# EasyEDA Pro project 智能母版V3.eprj

# Schematic Schematic1

## Sheets
1 电源: Create Date: 2024-02-19; Page Name: 电源; Project Name: 智能母版V3; Schematic Name: Schematic1; Update Date: 2024-02-22; Company: 嘉立创EDA; Page Size: A4; Version: V1.0
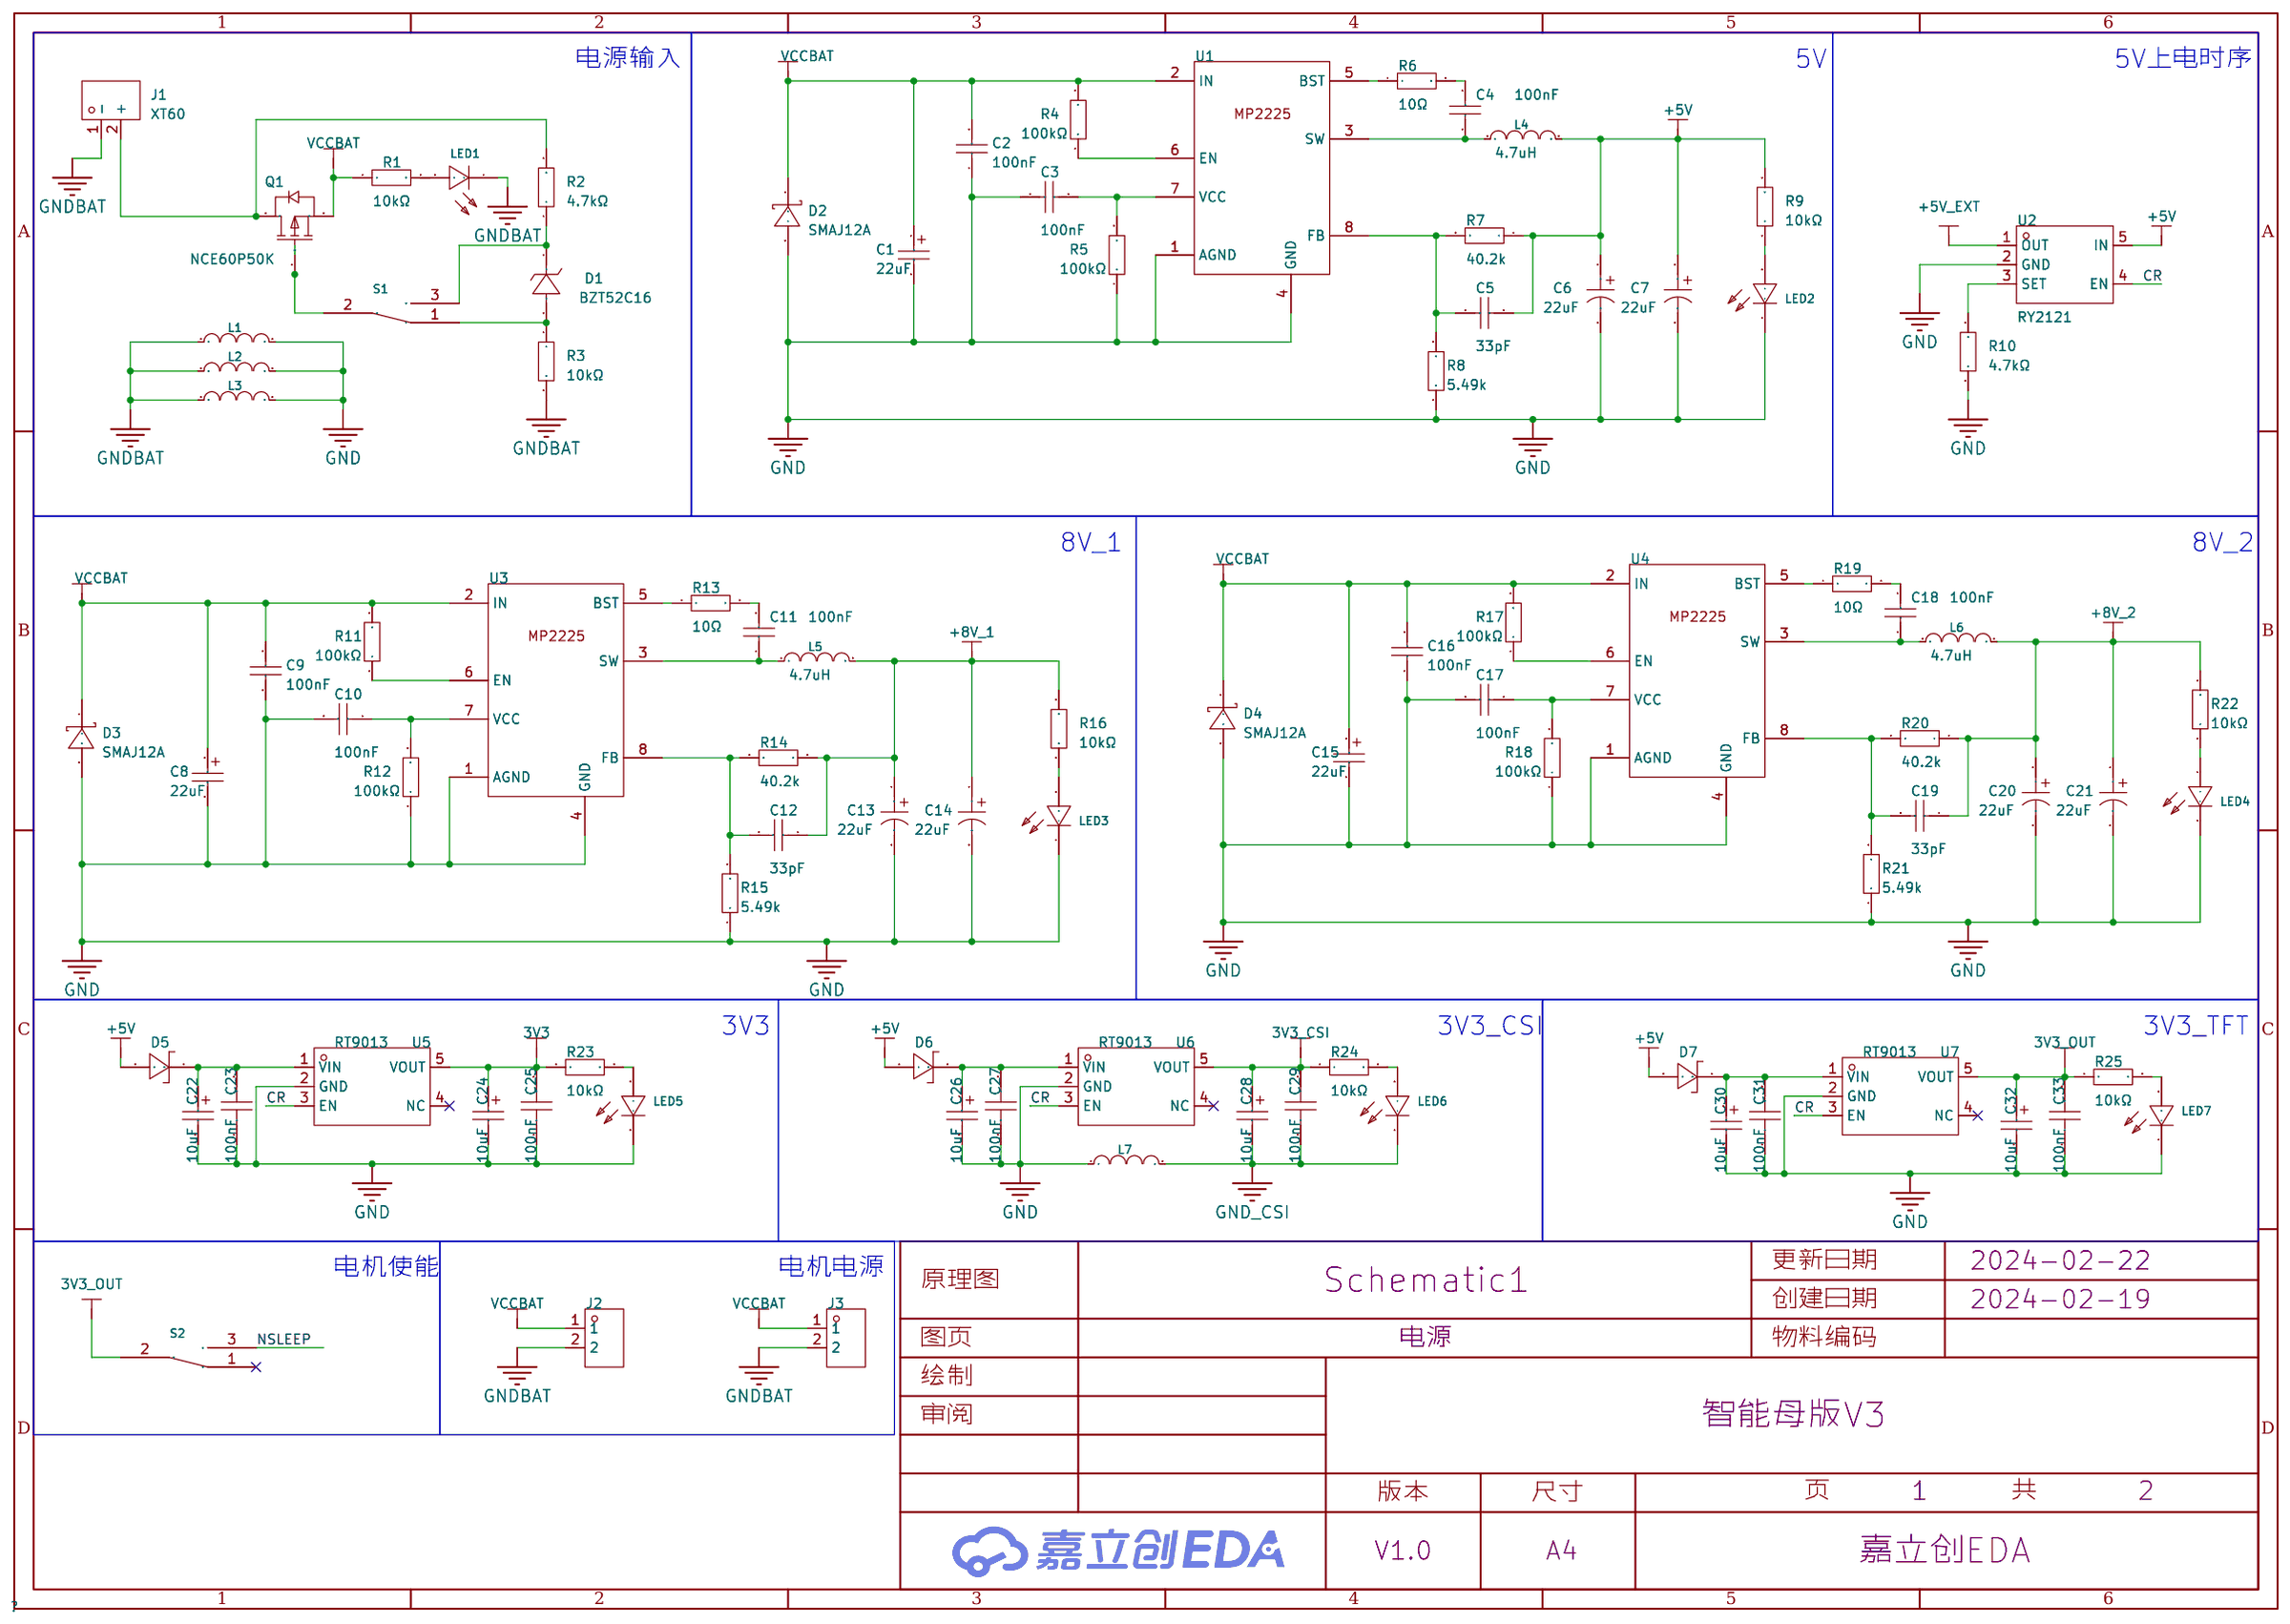
[diagram p0: 电源]
2 外设: Create Date: 2024-02-22; Page Name: 外设; Update Date: 2024-02-23
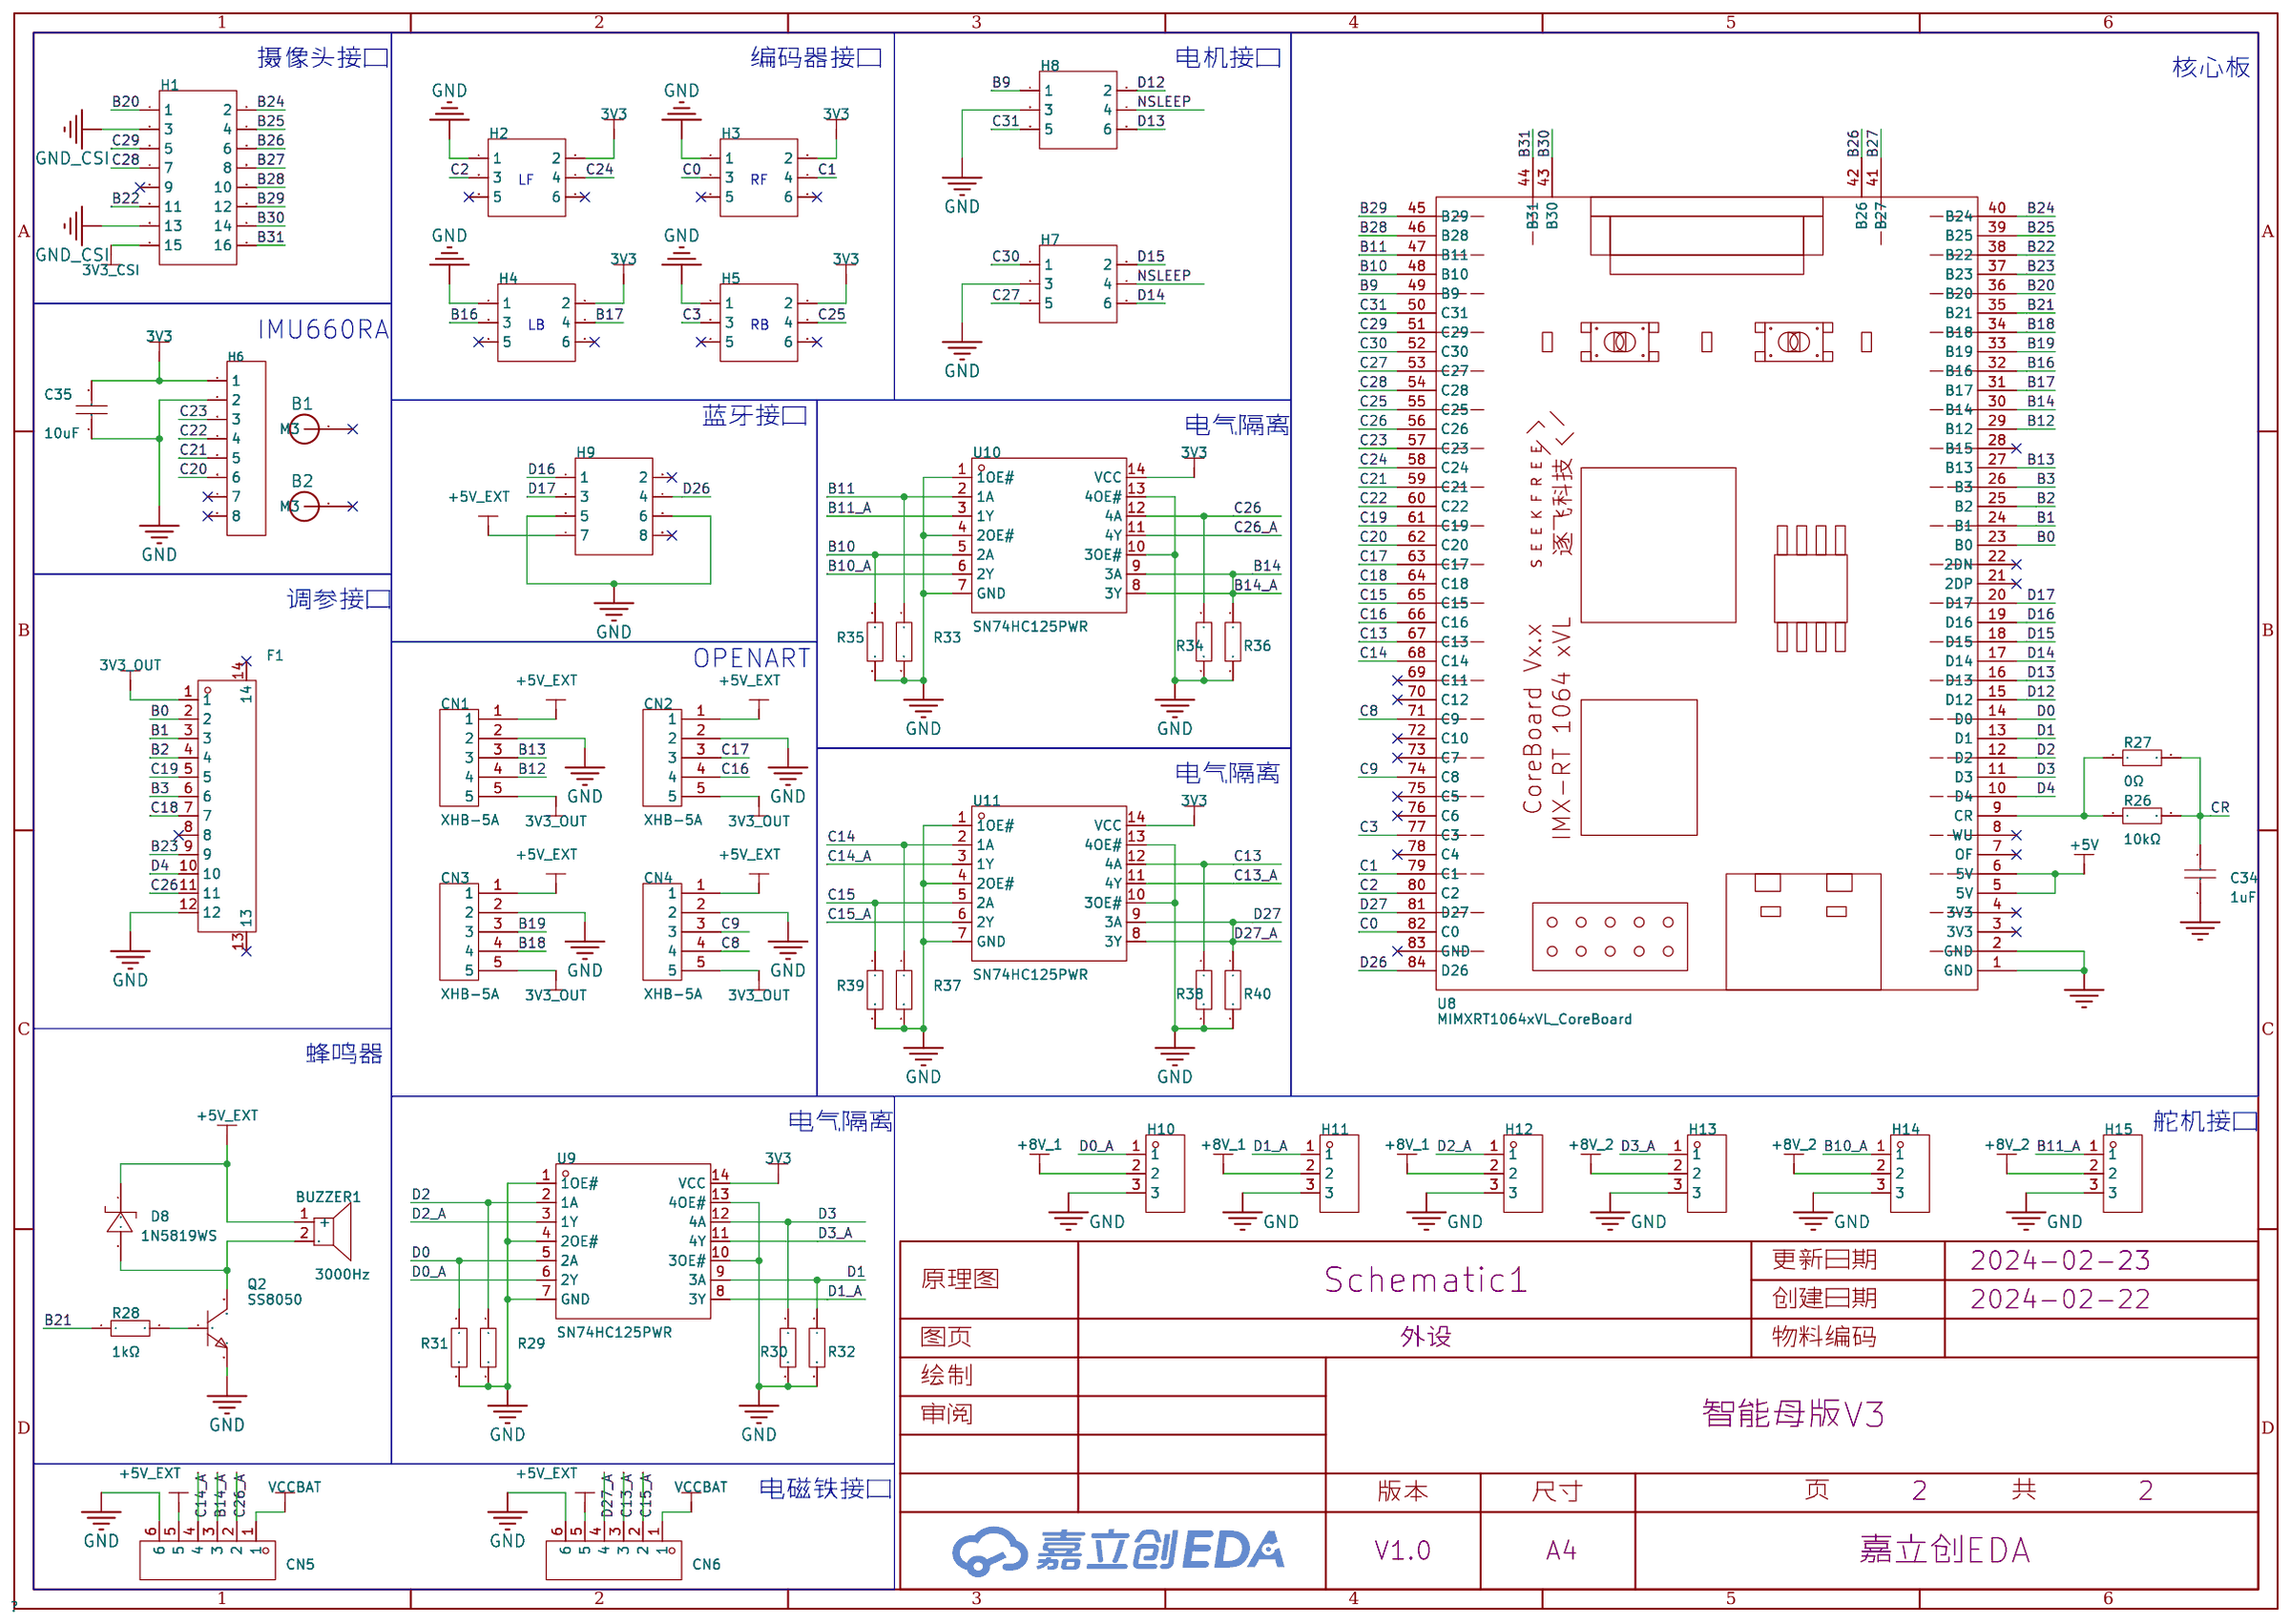
[diagram p1: 外设]

## Parts
sheet 外设
B1  M3螺柱孔_JX  [M3]
B2  M3螺柱孔_JX  [M3]
BUZZER1  3000Hz  [BUZ-TH_BD9.6-P5.00-D0.7-FD]
C34  1uF  [C0805]
C35  10uF  [C0805]
CN1  XHB-5A  [XHB-TH_5PIN-V-PITCH2.50-R]
CN2  XHB-5A  [XHB-TH_5PIN-V-PITCH2.50-R]
CN3  XHB-5A  [XHB-TH_5PIN-V-PITCH2.50-R]
CN4  XHB-5A  [XHB-TH_5PIN-V-PITCH2.50-R]
CN5  BX-HA2.54-6PZZ  [CONN-TH_6P-P2.50_BX-HA2.54-6PZZ]
CN6  BX-HA2.54-6PZZ  [CONN-TH_6P-P2.50_BX-HA2.54-6PZZ]
D8  1N5819WS  [SOD-323_L1.8-W1.3-LS2.5-RD]
F1  FPC-1.0FX-12PWCR-H20  [FPC-SMD_XUNPU_FPC-1.0FX-12PWCR-H20]
H1  -  [HDR-TH_16P-P2.54-V-F-R2-C8-S2.54-1]
H2  -  [HDR-TH_6P-P2.54-V-R2-C3-S2.54_A2541WV-2X3P]
H3  -  [HDR-TH_6P-P2.54-V-R2-C3-S2.54_A2541WV-2X3P]
H4  -  [HDR-TH_6P-P2.54-V-R2-C3-S2.54_A2541WV-2X3P]
H5  -  [HDR-TH_6P-P2.54-V-R2-C3-S2.54_A2541WV-2X3P]
H6  -  [HDR-TH_8P-P2.54-V-F-1]
H7  -  [HDR-TH_6P-P2.54-V-R2-C3-S2.54_A2541WV-2X3P]
H8  -  [HDR-TH_6P-P2.54-V-R2-C3-S2.54_A2541WV-2X3P]
H9  -  [HDR-TH_8P-P2.54-V-F-R2-C4-S2.54-1]
H10  -  [HDR-TH_3P-P2.54-V-M]
H11  -  [HDR-TH_3P-P2.54-V-M]
H12  -  [HDR-TH_3P-P2.54-V-M]
H13  -  [HDR-TH_3P-P2.54-V-M]
H14  -  [HDR-TH_3P-P2.54-V-M]
H15  -  [HDR-TH_3P-P2.54-V-M]
Q2  SS8050  [SOT-23-3_L2.9-W1.3-P1.90-LS2.4-BR]
R26  10kΩ  [R0603]
R27  0Ω  [R0603]
R28  1kΩ  [R0603]
R29  10kΩ  [R0603]
R30  10kΩ  [R0603]
R31  10kΩ  [R0603]
R32  10kΩ  [R0603]
R33  10kΩ  [R0603]
R34  10kΩ  [R0603]
R35  10kΩ  [R0603]
R36  10kΩ  [R0603]
R37  10kΩ  [R0603]
R38  10kΩ  [R0603]
R39  10kΩ  [R0603]
R40  10kΩ  [R0603]
U8  MIMXRT1064xVL_CoreBoard  [MIMXRT1064xVL_CoreBoard - 3D]
U9  SN74HC125PWR  [TSSOP-14_L5.0-W4.4-P0.65-LS6.5-BL]
U10  SN74HC125PWR  [TSSOP-14_L5.0-W4.4-P0.65-LS6.5-BL]
U11  SN74HC125PWR  [TSSOP-14_L5.0-W4.4-P0.65-LS6.5-BL]
sheet 电源
C1  22uF  [CAP-SMD_L6.0-W3.2-R-RD]
C2  100nF  [C0603]
C3  100nF  [C0603]
C4  100nF  [C0603]
C5  33pF  [C0603]
C6  22uF  [CAP-SMD_L3.2-W1.6]
C7  22uF  [CAP-SMD_L3.2-W1.6]
C8  22uF  [CAP-SMD_L6.0-W3.2-R-RD]
C9  100nF  [C0603]
C10  100nF  [C0603]
C11  100nF  [C0603]
C12  33pF  [C0603]
C13  22uF  [CAP-SMD_L3.2-W1.6]
C14  22uF  [CAP-SMD_L3.2-W1.6]
C15  22uF  [CAP-SMD_L6.0-W3.2-R-RD]
C16  100nF  [C0603]
C17  100nF  [C0603]
C18  100nF  [C0603]
C19  33pF  [C0603]
C20  22uF  [CAP-SMD_L3.2-W1.6]
C21  22uF  [CAP-SMD_L3.2-W1.6]
C22  10uF  [CASE-A_3216]
C23  100nF  [C0603]
C24  10uF  [CASE-A_3216]
C25  100nF  [C0603]
C26  10uF  [CASE-A_3216]
C27  100nF  [C0603]
C28  10uF  [CASE-A_3216]
C29  100nF  [C0603]
C30  10uF  [CASE-A_3216]
C31  100nF  [C0603]
C32  10uF  [CASE-A_3216]
C33  100nF  [C0603]
D1  BZT52C16  [SOD-123_L2.7-W1.6-LS3.7-RD]
D2  SMAJ12A  [SMA_L4.4-W2.7-LS5.1-RD]
D3  SMAJ12A  [SMA_L4.4-W2.7-LS5.1-RD]
D4  SMAJ12A  [SMA_L4.4-W2.7-LS5.1-RD]
D5  1N5819WS  [SOD-323_L1.8-W1.3-LS2.5-RD]
D6  1N5819WS  [SOD-323_L1.8-W1.3-LS2.5-RD]
D7  1N5819WS  [SOD-323_L1.8-W1.3-LS2.5-RD]
J1  XT60  [CONN-TH_XT60]
J2  KF301-5.0-2P  [CONN-TH_P5.00_KF301-5.0-2P]
J3  KF301-5.0-2P  [CONN-TH_P5.00_KF301-5.0-2P]
L1  CBG201209U000T  [L0805]
L2  CBG201209U000T  [L0805]
L3  CBG201209U000T  [L0805]
L4  4.7uH  [IND-SMD_L5.4-W5.2_FXL0530]
L5  4.7uH  [IND-SMD_L5.4-W5.2_FXL0530]
L6  4.7uH  [IND-SMD_L5.4-W5.2_FXL0530]
L7  CBG201209U000T  [L0805]
LED1  NCD0603R1  [LED0603-RD_RED]
LED2  NCD0603W1  [LED0603-RD]
LED3  NCD0603W1  [LED0603-RD]
LED4  NCD0603W1  [LED0603-RD]
LED5  NCD0603W1  [LED0603-RD]
LED6  NCD0603W1  [LED0603-RD]
LED7  NCD0603W1  [LED0603-RD]
Q1  NCE60P50K  [TO-252-2_L6.6-W6.1-P4.57-LS9.9-TL-CW]
R1  10kΩ  [R0603]
R2  4.7kΩ  [R0603]
R3  10kΩ  [R0603]
R4  100kΩ  [R0603]
R5  100kΩ  [R0603]
R6  10Ω  [R0603]
R7  40.2k  [R0603]
R8  5.49k  [R0603]
R9  10kΩ  [R0603]
R10  4.7kΩ  [R0603]
R11  100kΩ  [R0603]
R12  100kΩ  [R0603]
R13  10Ω  [R0603]
R14  40.2k  [R0603]
R15  5.49k  [R0603]
R16  10kΩ  [R0603]
R17  100kΩ  [R0603]
R18  100kΩ  [R0603]
R19  10Ω  [R0603]
R20  40.2k  [R0603]
R21  5.49k  [R0603]
R22  10kΩ  [R0603]
R23  10kΩ  [R0603]
R24  10kΩ  [R0603]
R25  10kΩ  [R0603]
S1  MT-0-102-A101-M200-RS  [SW-TH_MT-0-103-A101-M200-RS]  (no BOM)
S2  MT-0-102-A101-M200-RS  [SW-TH_MT-0-103-A101-M200-RS]  (no BOM)
U1  -  [tsot-23-8_l2.9-w1.6-p0.65-ls2.8-br]
U2  RY2121  [SOT-23-5_L3.0-W1.6-P0.95-LS2.8-BL]
U3  -  [tsot-23-8_l2.9-w1.6-p0.65-ls2.8-br]
U4  -  [tsot-23-8_l2.9-w1.6-p0.65-ls2.8-br]
U5  RT9013  [SOT-23-5_L2.9-W1.6-P0.95-LS2.8-BR]
U6  RT9013  [SOT-23-5_L2.9-W1.6-P0.95-LS2.8-BR]
U7  RT9013  [SOT-23-5_L2.9-W1.6-P0.95-LS2.8-BR]

## Library data of the parts
B1 B2 = M3螺柱孔_JX
BUZZER1 = HNB09A05: 驱动方式:有源(内含驱动线路);构造类型:电磁式;额定电压:5V;工作电压:4V~8V;频率:3000Hz;声压(SPL):85dB@5V,10cm;直径(φD):9mm;高度:5.7mm;; Supplier Part: C96493; Manufacturer: 华能; Supplier Footprint: 插件; JLCPCB Part Class: 扩展库; Datasheet: https://atta.szlcsc.com/upload/public/pdf/source/20170522/1495448327549.pdf; Supplier: LCSC; Oscillator Circuit: 有源(内含驱动线路); Technology Type: 电磁式; Rated Voltage: 5V; Operating Voltage: 4V~8V; Sound Pressure Level (SPL): 85dB@5V,10cm; Diameter (φD): 9mm; Height: 5.7mm
C34 = GCM21BR71H105KA03L: 容值:1uF;精度:±10%;额定电压:50V;材质(温度系数):X7R;; LCSC Part Name: 1uF ±10% 50V; Supplier Part: C126592; Manufacturer: muRata(村田); Supplier Footprint: 0805; JLCPCB Part Class: 扩展库; Datasheet: https://atta.szlcsc.com/upload/public/pdf/source/20170912/C126592_1505207918399963689.pdf; Supplier: LCSC; Tolerance: ±10%; Voltage Rated: 50V; Temperature Coefficient: X7R
C35 = CL21A106KAYNNNE_C15850: 容值:10uF;精度:±10%;额定电压:25V;材质(温度系数):X5R;; LCSC Part Name: 10uF ±10% 25V; Supplier Part: C15850; Manufacturer: SAMSUNG(三星); Manufacturer Part: CL21A106KAYNNNE; Supplier Footprint: 0805; JLCPCB Part Class: 基础库; Datasheet: https://atta.szlcsc.com/upload/public/pdf/source/20160103/1457707679302.pdf; Supplier: LCSC; Tolerance: ±10%; Voltage Rated: 25V; Temperature Coefficient: X5R
CN1-CN4 = XHB-5A: 插针结构:1x5P;间距:2.5mm;安装方式:-;参考系列:-;总PIN数:5P;排数:1;每排PIN数:5;行距:-;触头材质:-;; LCSC Part Name: 间距:2.5mm 1x5P; Supplier Part: C66559; Manufacturer: BOOMELE(博穆精密); Supplier Footprint: 插件,P=2.5mm; JLCPCB Part Class: 扩展库; Datasheet: https://atta.szlcsc.com/upload/public/pdf/source/20180809/C95477_BD1018113A27F451D6913E683B76B7C4.pdf; Supplier: LCSC; Pins Structure: 1x5P; Pitch: 2.5mm; Number of Pins: 5P; Number of Rows: 1; Number of PINs Per Row: 5
CN5 CN6 = BX-HA2.54-6PZZ: 插针结构:1x6P;间距:2.54mm;安装方式:直插;参考系列:HA;总PIN数:6P;排数:1;每排PIN数:6;行距:-;额定电流:3A;触头材质:黄铜;触头镀层:锡;工作温度范围:-25℃~+85℃;; LCSC Part Name: 1x6P 间距:2.54mm 直插 系列:HA; Supplier Part: C18077819; Manufacturer: Bossie(博锡); Supplier Footprint: 插件,P=2.54mm; JLCPCB Part Class: 扩展库; Datasheet: https://atta.szlcsc.com/upload/public/pdf/source/20231017/97F73B7426CEC2CCBB6B5387789B9E6D.pdf; Supplier: LCSC; Pins Structure: 1x6P; Pitch: 2.54mm; Mounting Style: 直插; Reference Series: HA; Number of Pins: 6P; Number of Rows: 1; Number of PINs Per Row: 6; Current Rating (Max): 3A; Contact Material: 黄铜; Contact Plating: 锡; Operating Temperature Range: -25℃~+85℃
D5-D8 = 1N5819WS_C191023: 直流反向耐压(Vr):40V;平均整流电流(Io):1A;正向压降(Vf):600mV@1A;; LCSC Part Name: 40V 1A 600mV@1A; Supplier Part: C191023; Manufacturer: Hottech(合科泰); Supplier Footprint: SOD-323; JLCPCB Part Class: 基础库; Datasheet: https://atta.szlcsc.com/upload/public/pdf/source/20220428/3CB86FD8D28D653594B4E35F9D5AEFD9.pdf; Supplier: LCSC; Reverse Voltage (Vr): 40V; Average Rectified Current (Io): 1A; Forward Voltage (Vf@If): 600mV@1A
F1 = FPC-1.0FX-12PWCR-H20: 锁定特性:翻盖式;触点类型:下接;触点数量:12P;间距:1mm;安装类型:卧贴;; LCSC Part Name: 间距:1mm P数:12P 翻盖式 下接; Supplier Part: C19269355; Manufacturer: XUNPU(讯普); Supplier Footprint: SMD,P=1mm,卧贴; Datasheet: https://atta.szlcsc.com/upload/public/pdf/source/20231121/46D1D420E162B395A0FFF09C3BB98E72.pdf; Supplier: LCSC; Locking Feature: 翻盖式; Contact Type: 下接; Number of Contacts: 12P; Pitch: 1mm; Mounting Type: 卧贴; Height Above Board: 2mm
H1 = HDR-F_2.54_2x8: Supplier Part: C30734; Supplier Footprint: 插件
H2-H5 H7 H8 = HDR-M_2.54_2x3: Supplier Part: C402781; Supplier Footprint: 插件,P=2.54mm
H6 = HDR-F_2.54_1x8P: Supplier Part: C27438; Supplier Footprint: 插件
H9 = HDR-F_2.54_2x4: Supplier Part: C92271; Supplier Footprint: 插件
H10-H15 = HDR-M_2.54_1x3P: Supplier Part: C2937625; Supplier Footprint: 插件
Q2 = SS8050_C2150: 晶体管类型:NPN;集射极击穿电压(Vceo):25V;集电极电流(Ic):1.5A;功率(Pd):300mW;直流电流增益(hFE@Ic,Vce):200@100mA,1V;; LCSC Part Name: NPN 25V 1.5A Y1 200-350; Supplier Part: C2150; Manufacturer: CJ(江苏长电/长晶); Supplier Footprint: SOT-23; JLCPCB Part Class: 基础库; Datasheet: https://atta.szlcsc.com/upload/public/pdf/source/20230322/AEE86F4B043774EFF80CAEA14A37D9E9.pdf; Supplier: LCSC; Transistor Type: NPN; Collector-Emitter Breakdown Voltage (Vceo): 25V; Collector Current (Ic): 1.5A; Power Dissipation (Pd): 300mW; Collector Cut-Off Current (Icbo): 100nA; Collector-Emitter Saturation Voltage (VCE(sat)@Ic,Ib): 500mV@800mA,80mA; DC Current Gain (hFE@Ic,Vce): 200@100mA,1V; Transition Frequency (fT): 100MHz; Operating Temperature: +150℃@(Tj)
R26 = RT0603BRD0710KL: 电阻类型:薄膜电阻;阻值:10kΩ;精度:±0.1%;功率:100mW;最大工作电压:75V;温度系数:±25ppm/℃;; LCSC Part Name: 薄膜电阻 10kΩ ±0.1% 100mW; Supplier Part: C95204; Manufacturer: YAGEO(国巨); Supplier Footprint: 0603; JLCPCB Part Class: 扩展库; Datasheet: https://atta.szlcsc.com/upload/public/pdf/source/20170217/1487301593756.pdf; Supplier: LCSC; Type: 薄膜电阻; Tolerance: ±0.1%; Power(Watts): 100mW; Overload Voltage (Max): 75V; Temperature Coefficient: ±25ppm/℃; Operating Temperature Range: -55℃~+155℃
R27 = RC0603FR-070RL: 电阻类型:厚膜电阻;阻值:0Ω;精度:±1%;功率:100mW;最大工作电压:75V;温度系数:-;; LCSC Part Name: 厚膜电阻 0Ω ±1% 100mW; Supplier Part: C100044; Manufacturer: YAGEO(国巨); Supplier Footprint: 0603; JLCPCB Part Class: 扩展库; Datasheet: https://atta.szlcsc.com/upload/public/pdf/source/20180316/70C0E2BDAE7FCC62C531A5A58D202EE1.pdf; Supplier: LCSC; Type: 厚膜电阻; Tolerance: ±1%; Power(Watts): 100mW; Overload Voltage (Max): 75V; Operating Temperature Range: -55℃~+155℃
R28 = 0603WAF1001T5E: 电阻类型:厚膜电阻;阻值:1kΩ;精度:±1%;功率:100mW;; LCSC Part Name: 1kΩ ±1% 100mW; Supplier Part: C21190; Manufacturer: UNI-ROYAL(厚声); Supplier Footprint: 0603; JLCPCB Part Class: Basic Part; Datasheet: https://atta.szlcsc.com/upload/public/pdf/source/20200306/C422600_1E6D84923E4A46A82E41ADD87F860B5C.pdf; Supplier: LCSC; Type: 厚膜电阻; Tolerance: ±1%; Power(Watts): 100mW; Temperature Coefficient: ±100ppm/℃; Overload Voltage (Max): 75V; Operating Temperature Range: -55℃~+155℃
R1 R3 R9 R10 R16 R22-R25 R29-R40 = 0603WAF1002T5E: 电阻类型:厚膜电阻;阻值:10kΩ;精度:±1%;功率:100mW;; LCSC Part Name: 厚膜电阻 10kΩ ±1% 100mW; Supplier Part: C25804; Manufacturer: UNI-ROYAL(厚声); Supplier Footprint: 0603; JLCPCB Part Class: 基础库; Datasheet: https://atta.szlcsc.com/upload/public/pdf/source/20200306/C422600_1E6D84923E4A46A82E41ADD87F860B5C.pdf; Supplier: LCSC; Type: 厚膜电阻; Tolerance: ±1%; Power(Watts): 100mW; Temperature Coefficient: ±100ppm/℃; Overload Voltage (Max): 75V; Operating Temperature Range: -55℃~+155℃
U8 = MIMXRT1064xVL_CoreBoard
U9-U11 = SN74HC125PWR: 类型:缓冲器，非反相;电源电压:2V~6V;输入类型:-;输出类型:三态;低电平输出电流(IOL):7.8mA;高电平输出电流(IOH):7.8mA;工作温度:-40℃~+85℃;; Supplier Part: C132994; Manufacturer: TI(德州仪器); Supplier Footprint: TSSOP-14; JLCPCB Part Class: Extended Part; Datasheet: https://atta.szlcsc.com/upload/public/pdf/source/20170930/C132994_1506736365150997346.pdf; Supplier: LCSC; Type: 缓冲器，非反相; Supply Voltage: 2V~6V; output type: 三态; Current-OutputLow: 7.8mA; Current-OutputHigh: 7.8mA; Operating temperature: -40℃~+85℃
C1 C8 C15 = TAJC226K025RNJ: 容值:22uF;精度:±10%;额定电压:25V;等效串联电阻:1.4Ω@100kHz;; LCSC Part Name: 22uF ±10% 25V; Supplier Part: C7214; Manufacturer: Kyocera AVX; Supplier Footprint: CASE-C-6032; JLCPCB Part Class: Extended Part; Datasheet: https://atta.szlcsc.com/upload/public/pdf/source/20160107/1457707749198.pdf; Supplier: LCSC; Tolerance: ±10%; Rated Voltage: 25V; Equivalent Series Resistance(ESR): 1.4Ω@100kHz; Operating Temperature: -55℃~+125℃
C2-C4 C9-C11 C16-C18 = 0603B104K500NT: 容值:100nF;精度:±10%;额定电压:50V;材质(温度系数):X7R;; LCSC Part Name: 100nF ±10% 50V; Supplier Part: C30926; Manufacturer: FH(风华); Supplier Footprint: 0603; JLCPCB Part Class: Extended Part; Datasheet: https://atta.szlcsc.com/upload/public/pdf/source/20170923/C30926_1506149436298988724.pdf; Supplier: LCSC; Tolerance: ±10%; Voltage Rated: 50V; Temperature Coefficient: X7R
C5 C12 C19 = CL10C330JB8NNNC: 容值:33pF;精度:±5%;额定电压:50V;材质(温度系数):C0G;; LCSC Part Name: 33pF ±5% 50V; Supplier Part: C1663; Manufacturer: SAMSUNG(三星); Supplier Footprint: 0603; JLCPCB Part Class: 基础库; Datasheet: https://atta.szlcsc.com/upload/public/pdf/source/20160103/1457707688366.pdf; Supplier: LCSC; Tolerance: ±5%; Voltage Rated: 50V; Temperature Coefficient: C0G
C6 C7 C13 C14 C20 C21 = CA45-A-16V-22uF-K: 容值:22uF;精度:±10%;额定电压:16V;等效串联电阻:6Ω@100kHz;; LCSC Part Name: 22uF ±10% 16V; Supplier Part: C782264; Manufacturer: CEC(振华新云); Supplier Footprint: CASE-A-3216; JLCPCB Part Class: Extended Part; Datasheet: https://atta.szlcsc.com/upload/public/pdf/source/20200909/C782264_D6D9C4EF3B25E81633C26A9294FBB820.pdf; Supplier: LCSC; Tolerance: ±10%; Rated Voltage: 16V; Equivalent Series Resistance(ESR): 6Ω@100kHz; Operating Temperature: -55℃~+125℃
C22 C24 C26 C28 C30 C32 = CA45-A-10V-10uF-M: 容值:10uF;精度:±20%;额定电压:10V;等效串联电阻:8Ω@100kHz;工作温度:-55~+125;; LCSC Part Name: 10uF ±20% 10V; Supplier Part: C128256; Manufacturer: CEC(振华新云); JLCPCB Part Class: Extended Part; Datasheet: https://atta.szlcsc.com/upload/public/pdf/source/20171113/C128256_15105610660201115413.pdf; Supplier: LCSC; Tolerance: ±20%; Rated Voltage: 10V; Equivalent Series Resistance(ESR): 8Ω@100kHz; Operating Temperature: -55~+125
C23 C25 C27 C29 C31 C33 = CAP_0603: Supplier Footprint: 0603
D1 = BZT52C16: 稳压值(标称值):-;精度:-;功率:500mW;反向电流(Ir):100nA@11.2V;; LCSC Part Name: 500mW; Supplier Part: C707145; Manufacturer: Slkor(萨科微); Supplier Footprint: SOD-123; JLCPCB Part Class: 扩展库; Datasheet: https://atta.szlcsc.com/upload/public/pdf/source/20200721/C707125_BAEA70ACC1B0F60BBAC1FD71D8806D24.pdf; Supplier: LCSC; Power Dissipation: 500mW; Reverse Leakage Current (Ir): 100nA@11.2V
D2-D4 = SMAJ12A_C152123: 极性:单向;反向截止电压(Vrwm):12V;击穿电压:13.3V;峰值脉冲电流(Ipp)@10/1000μs:20.1A;最大钳位电压:19.9V;; LCSC Part Name: 单向 Vrwm:12V; Supplier Part: C152123; Manufacturer: BORN(伯恩半导体); Supplier Footprint: SMA(DO-214AC); JLCPCB Part Class: 扩展库; Datasheet: https://atta.szlcsc.com/upload/public/pdf/source/20181205/C152123_F062F647BF686681D55A64EEC7CBEC59.pdf; Supplier: LCSC; Polarity: 单向; Reverse Stand-Off Voltage (Vrwm): 12V; Breakdown Voltage: 13.3V; Peak Pulse Current (Ipp)@10/1000μs: 20.1A; Maximum Clamping Voltage: 19.9V
J1 = XT60: 类别:-;类型1:-;; LCSC Part Name: AMASS(艾迈斯) XT60模型插头 3.5mm镀金香蕉头公头（电调端）XT60-M; Supplier Part: C98733; Manufacturer: AMASS(艾迈斯); JLCPCB Part Class: 扩展库; Datasheet: https://atta.szlcsc.com/upload/public/pdf/source/20170606/1496716524919.pdf; Supplier: LCSC; Brand: 艾迈斯; Type: 香蕉头; Colour: 黄色; InterfaceType: 公头; specifications: 3.5mm
J2 J3 = KF301-5.0-2P: 间距:5mm;排数:1;每排PIN数:2;安装方式:直针;额定电流:17A;额定电压:250V;线规 - AWG:14~22;线规 - mm?:1.5;工作温度范围:-30℃~+120℃;颜色:蓝色;; LCSC Part Name: 5mm 排数:1 每排P数:2 直针 可拼接 铜 环保; Supplier Part: C474881; Manufacturer: KEFA(科发); Supplier Footprint: 直插,P=5mm; JLCPCB Part Class: Extended Part; Datasheet: https://atta.szlcsc.com/upload/public/pdf/source/20200115/C474881_883EFE2003339C40FD1BEEEFC9A18423.pdf; Supplier: LCSC; Pitch: 5mm; Number of Rows: 1; Number of PINs Per Row: 2; Mounting Style: 直针; Current Rating (Max): 17A; Voltage Rating (Max): 250V; Wire Gauge - AWG: 14~22; Wire Gauge - mm?: 1.5; Operating Temperature Range: -30℃~+120℃; Color: 蓝色
L1-L3 L7 = CBG201209U000T: 标称阻抗@测试频率:0Ω@100MHz;直流电阻(RDC):80mΩ;; LCSC Part Name: 单路 0805磁珠 阻抗0Ω@100MHz; Supplier Part: C91037; Manufacturer: FH(风华); Supplier Footprint: 0805; JLCPCB Part Class: 扩展库; Datasheet: https://atta.szlcsc.com/upload/public/pdf/source/20161217/1481939213023.pdf; Supplier: LCSC; Impedance @ Frequency: 0Ω@100MHz; DC Resistance: 80mΩ; Current Rating: 900mA; Circuits: 1
L4-L6 = FXL0530-4R7-M: 电感值:4.7uH;精度:±20%;额定电流:4.5A;饱和电流(Isat):5A;; LCSC Part Name: 4.7uH ±20% 4.5A 50mΩ; Supplier Part: C177246; Manufacturer: cjiang(长江微电); Supplier Footprint: SMD,5.4x5.2x2.8mm; JLCPCB Part Class: Extended Part; Supplier: LCSC; Tolerance: ±20%; Rated Current: 4.5A; Saturation Current (Isat): 5A; DC Resistance (DCR): 50mΩ
LED1 = NCD0603R1_C84263: 发光颜色:红灯;; LCSC Part Name: 红灯 0603红灯   正贴; Supplier Part: C84263; Manufacturer: 国星光电; Supplier Footprint: 0603; JLCPCB Part Class: Extended Part; Datasheet: https://atta.szlcsc.com/upload/public/pdf/source/20200820/C84263_DABC6A75E58F576973B407FDBA283D60.pdf; Supplier: LCSC; Emitted Color: 红灯
LED2-LED7 = NCD0603W1: 发光颜色:白灯;; LCSC Part Name: 白灯 0603白灯   正贴; Supplier Part: C84265; Manufacturer: 国星光电; Supplier Footprint: 0603; JLCPCB Part Class: Extended Part; Datasheet: https://atta.szlcsc.com/upload/public/pdf/source/20200820/C84265_479E6193713348A548E5CD6D9278BF16.pdf; Supplier: LCSC; Emitted Color: 白灯
Q1 = NCE60P50K: 类型:P沟道;漏源电压(Vdss):60V;连续漏极电流(Id):50A;功率(Pd):95W;导通电阻(RDS(on)@Vgs,Id):23mΩ@10V,20A;阈值电压(Vgs(th)@Id):3.5V@250uA;; LCSC Part Name: P沟道 60V 50A; Supplier Part: C130104; Manufacturer: NCE(无锡新洁能); Supplier Footprint: TO-252-2(DPAK); JLCPCB Part Class: 扩展库; Datasheet: https://atta.szlcsc.com/upload/public/pdf/source/20170919/C130104_1505787180031976877.pdf; Supplier: LCSC; Type: P沟道; Drain Source Voltage (Vdss): 60V; Continuous Drain Current (Id): 50A; Power Dissipation (Pd): 95W; Drain Source On Resistance (RDS(on)@Vgs,Id): 23mΩ@10V,20A; Gate Threshold Voltage (Vgs(th)@Id): 3.5V@250uA
R2 = 0603WAF4701T5E: 电阻类型:厚膜电阻;阻值:4.7kΩ;精度:±1%;功率:100mW;; LCSC Part Name: 4.7kΩ ±1% 100mW; Supplier Part: C23162; Manufacturer: UNI-ROYAL(厚声); Supplier Footprint: 0603; JLCPCB Part Class: Basic Part; Datasheet: https://atta.szlcsc.com/upload/public/pdf/source/20200306/C422600_1E6D84923E4A46A82E41ADD87F860B5C.pdf; Supplier: LCSC; Type: 厚膜电阻; Tolerance: ±1%; Power(Watts): 100mW; Temperature Coefficient: ±100ppm/℃; Overload Voltage (Max): 75V; Operating Temperature Range: -55℃~+155℃
R4 R5 R11 R12 R17 R18 = RC0603FR-07100KL: 电阻类型:厚膜电阻;阻值:100kΩ;精度:±1%;功率:100mW;; LCSC Part Name: 100kΩ ±1% 100mW; Supplier Part: C14675; Manufacturer: YAGEO(国巨); Supplier Footprint: 0603; JLCPCB Part Class: Extended Part; Datasheet: https://atta.szlcsc.com/upload/public/pdf/source/20140324/1457707028752.pdf; Supplier: LCSC; Type: 厚膜电阻; Tolerance: ±1%; Power(Watts): 100mW; Temperature Coefficient: ±100ppm/℃; Overload Voltage (Max): 75V; Operating Temperature Range: -55℃~+155℃
R6 R13 R19 = 0603WAF100JT5E: 电阻类型:厚膜电阻;阻值:10Ω;精度:±1%;功率:100mW;; LCSC Part Name: 10Ω ±1% 100mW; Supplier Part: C22859; Manufacturer: UNI-ROYAL(厚声); Supplier Footprint: 0603; JLCPCB Part Class: Basic Part; Datasheet: https://atta.szlcsc.com/upload/public/pdf/source/20200306/C422600_1E6D84923E4A46A82E41ADD87F860B5C.pdf; Supplier: LCSC; Type: 厚膜电阻; Tolerance: ±1%; Power(Watts): 100mW; Temperature Coefficient: ±400ppm/℃; Overload Voltage (Max): 75V; Operating Temperature Range: -55℃~+155℃
R7 R14 R20 = 0603WAF4022T5E: 电阻类型:厚膜电阻;阻值:40.2kΩ;精度:±1%;功率:100mW;; LCSC Part Name: 40.2kΩ ±1% 100mW; Supplier Part: C12447; Manufacturer: UNI-ROYAL(厚声); Supplier Footprint: 0603; JLCPCB Part Class: Basic Part; Datasheet: https://atta.szlcsc.com/upload/public/pdf/source/20200306/C422600_1E6D84923E4A46A82E41ADD87F860B5C.pdf; Supplier: LCSC; Type: 厚膜电阻; Tolerance: ±1%; Power(Watts): 100mW; Temperature Coefficient: ±100ppm/℃; Overload Voltage (Max): 75V; Operating Temperature Range: -55℃~+155℃
R8 R15 R21 = 0603WAF5491T5E: 电阻类型:厚膜电阻;阻值:5.49kΩ;精度:±1%;功率:100mW;; LCSC Part Name: 5.49kΩ ±1% 100mW; Supplier Part: C23069; Manufacturer: UNI-ROYAL(厚声); Supplier Footprint: 0603; JLCPCB Part Class: Extended Part; Datasheet: https://atta.szlcsc.com/upload/public/pdf/source/20200306/C422600_1E6D84923E4A46A82E41ADD87F860B5C.pdf; Supplier: LCSC; Type: 厚膜电阻; Tolerance: ±1%; Power(Watts): 100mW; Temperature Coefficient: ±100ppm/℃; Overload Voltage (Max): 75V; Operating Temperature Range: -55℃~+155℃
S1 S2 = MT-0-102-A101-M200-RS: 额定电流:5A;额定电压(AC):125V;电路结构:单刀双掷;机械寿命:-;安装方式:直插;; LCSC Part Name: 小型钮子三脚二档 二件套 含配件; Supplier Part: C1788492; Manufacturer: YUEN FUNG(源丰); Supplier Footprint: 插件; JLCPCB Part Class: 扩展库; Datasheet: https://atta.szlcsc.com/upload/public/pdf/source/20230720/8E5C36EFDF374AE4FF4AC09DB233CE0E.pdf; Supplier: LCSC; Contact Current: 5A; Voltage Rating (AC): 125V; Circuit: 单刀双掷; Actuator Type: 圆柱钮柄; Pin Style: 焊片; Mounting Style: 直插; Operating Temperature: -25℃~+85℃; Switch Length: 13mm; Switch Width: 8mm; Switch Height: 28.6mm
U1 U3 U4 = MP2225: DC-DC芯片
U2 = RY2121: Supplier Part: C2887853; Manufacturer: RYCHiP(蕊源); Supplier Footprint: SOT-23-5; JLCPCB Part Class: 扩展库; Datasheet: https://atta.szlcsc.com/upload/public/pdf/source/20210826/0463BBCFA36A5F74D180B73203B8A119.pdf; Supplier: LCSC
U5-U7 = RT9013-30GB: LCSC Part Name: CMOS LDO Regulator; Supplier Part: C3031664; Manufacturer: RICHTEK(台湾立锜); Supplier Footprint: SOT-23-5; Datasheet: https://atta.szlcsc.com/upload/public/pdf/source/20151126/1457707591671.pdf; Supplier: LCSC

## Nets
3V3: C24.1 C25.2 C35.2 H2.2 H3.2 H4.2 H5.2 H6.1 R23.1 U5.5(VOUT) U9.14(VCC) U10.14(VCC) U11.14(VCC)
3V3_CSI: C28.1 C29.2 H1.15 R24.1 U6.5(VOUT)
3V3_OUT: C32.1 C33.2 CN1.5 CN2.5 CN3.5 CN4.5 F1.1 R25.1 S2.2 U7.5(VOUT)
+5V: C5.1 C6.1 C7.1 D5.2(A) D6.2(A) D7.2(A) L4.2 R7.1 R9.2 U2.5(IN) U8.5(5V) U8.6(5V)
+5V_EXT: BUZZER1.1(+) CN1.1 CN2.1 CN3.1 CN4.1 CN5.5 CN6.5 D8.1(C) H9.7 U2.1(OUT)
+8V_1: C12.1 C13.1 C14.1 H10.2 H11.2 H12.2 L5.2 R14.1 R16.2
+8V_2: C19.1 C20.1 C21.1 H13.2 H14.2 H15.2 L6.2 R20.1 R22.2
GND: C1.2 C2.1 C3.2 C6.2 C7.2 C8.2 C9.1 C10.2 C13.2 C14.2 C15.2 C16.1 C17.2 C20.2 C21.2 C22.2 C23.1 C24.2 C25.1 C26.2 C27.1 C30.2 C31.1 C32.2 C33.1 C34.1 C35.1 CN1.2 CN2.2 CN3.2 CN4.2 CN5.6 CN6.6 D2.2(A) D3.2(A) D4.2(A) F1.12 H2.1 H3.1 H4.1 H5.1 H6.2 H7.3 H8.3 H9.5 H9.6 H10.3 H11.3 H12.3 H13.3 H14.3 H15.3 L1.2 L2.2 L3.2 L7.1 LED2.1(-) LED3.1(-) LED4.1(-) LED5.1(-) LED7.1(-) Q2.2(E) R5.1 R8.1 R10.1 R12.1 R15.1 R18.1 R21.1 R29.2 R30.2 R31.2 R32.2 R33.2 R34.2 R35.2 R36.2 R37.2 R38.2 R39.2 R40.2 U1.1(AGND) U1.4(GND) U2.2(GND) U3.1(AGND) U3.4(GND) U4.1(AGND) U4.4(GND) U5.2(GND) U6.2(GND) U7.2(GND) U8.1(GND) U8.2(GND) U9.1(1OE#) U9.4(2OE#) U9.7(GND) U9.10(3OE#) U9.13(4OE#) U10.1(1OE#) U10.4(2OE#) U10.7(GND) U10.10(3OE#) U10.13(4OE#) U11.1(1OE#) U11.4(2OE#) U11.7(GND) U11.10(3OE#) U11.13(4OE#)
GND_CSI: C28.2 C29.1 H1.3 H1.13 L7.2 LED6.1(-)
GNDBAT: J1.1(-) J2.2 J3.2 L1.1 L2.1 L3.1 LED1.1(K) R3.2
VCCBAT: C1.1 C2.2 C8.1 C9.2 C15.1 C16.2 CN5.1 CN6.1 D2.1(K) D3.1(K) D4.1(K) J2.1 J3.1 Q1.2(D) R1.1 R4.2 R11.2 R17.2 U1.2(IN) U3.2(IN) U4.2(IN)
B0: F1.2 U8.23(B0)
B1: F1.3 U8.24(B1)
B2: F1.4 U8.25(B2)
B3: F1.6 U8.26(B3)
B9: H8.1 U8.49(B9)
B10: R35.1 U8.48(B10) U10.5(2A)
B10_A: H14.1 U10.6(2Y)
B11: R33.1 U8.47(B11) U10.2(1A)
B11_A: H15.1 U10.3(1Y)
B12: CN1.4 U8.29(B12)
B13: CN1.3 U8.27(B13)
B14: R36.1 U8.30(B14) U10.9(3A)
B14_A: CN5.3 U10.8(3Y)
B16: H4.3 U8.32(B16)
B17: H4.4 U8.31(B17)
B18: CN3.4 U8.34(B18)
B19: CN3.3 U8.33(B19)
B20: H1.1 U8.36(B20)
B21: R28.1 U8.35(B21)
B22: H1.11 U8.38(B22)
B23: F1.9 U8.37(B23)
B24: H1.2 U8.40(B24)
B25: H1.4 U8.39(B25)
B26: H1.6 U8.42(B26)
B27: H1.8 U8.41(B27)
B28: H1.10 U8.46(B28)
B29: H1.12 U8.45(B29)
B30: H1.14 U8.43(B30)
B31: H1.16 U8.44(B31)
C0: H3.3 U8.82(C0)
C1: H3.4 U8.79(C1)
C2: H2.3 U8.80(C2)
C3: H5.3 U8.77(C3)
C8: CN4.4 U8.71(C9)
C9: CN4.3 U8.74(C8)
C13: R38.1 U8.67(C13) U11.12(4A)
C13_A: CN6.3 U11.11(4Y)
C14: R37.1 U8.68(C14) U11.2(1A)
C14_A: CN5.4 U11.3(1Y)
C15: R39.1 U8.65(C15) U11.5(2A)
C15_A: CN6.2 U11.6(2Y)
C16: CN2.4 U8.66(C16)
C17: CN2.3 U8.63(C17)
C18: F1.7 U8.64(C18)
C19: F1.5 U8.61(C19)
C20: H6.6 U8.62(C20)
C21: H6.5 U8.59(C21)
C22: H6.4 U8.60(C22)
C23: H6.3 U8.57(C23)
C24: H2.4 U8.58(C24)
C25: H5.4 U8.55(C25)
C26: F1.11 R34.1 U8.56(C26) U10.12(4A)
C26_A: CN5.2 U10.11(4Y)
C27: H7.5 U8.53(C27)
C28: H1.7 U8.54(C28)
C29: H1.5 U8.51(C29)
C30: H7.1 U8.52(C30)
C31: H8.5 U8.50(C31)
CR: C34.2 R26.2 R27.2 U2.4(EN) U5.3(EN) U6.3(EN) U7.3(EN)
D0: R31.1 U8.14(D0) U9.5(2A)
D0_A: H10.1 U9.6(2Y)
D1: R32.1 U8.13(D1) U9.9(3A)
D1_A: H11.1 U9.8(3Y)
D2: R29.1 U8.12(D2) U9.2(1A)
D2_A: H12.1 U9.3(1Y)
D3: R30.1 U8.11(D3) U9.12(4A)
D3_A: H13.1 U9.11(4Y)
D4: F1.10 U8.10(D4)
D12: H8.2 U8.15(D12)
D13: H8.6 U8.16(D13)
D14: H7.6 U8.17(D14)
D15: H7.2 U8.18(D15)
D16: H9.1 U8.19(D16)
D17: H9.3 U8.20(D17)
D26: H9.4 U8.84(D26)
D27: R40.1 U8.81(D27) U11.9(3A)
D27_A: CN6.4 U11.8(3Y)
NSLEEP: H7.4 H8.4 S2.3
$1N429: D1.1(K) R2.1 S1.3
$1N430: D1.2(A) R3.1 S1.1
$1N431: J1.2(+) Q1.3(S) R2.2
$1N432: Q1.1(G) S1.2
$1N517: LED1.2(A) R1.2
$1N1245: C4.1 L4.1 U1.3(SW)
$1N1251: R4.1 U1.6(EN)
$1N1253: C3.1 R5.2 U1.7(VCC)
$1N1255: C5.2 R7.2 R8.2 U1.8(FB)
$1N1256: C4.2 R6.2
$1N1257: R6.1 U1.5(BST)
$1N1421: LED2.2(+) R9.1
$1N3692: R10.2 U2.3(SET)
$1N4397: C11.1 L5.1 U3.3(SW)
$1N4399: R11.1 U3.6(EN)
$1N4400: C10.1 R12.2 U3.7(VCC)
$1N4402: C12.2 R14.2 R15.2 U3.8(FB)
$1N4403: C11.2 R13.2
$1N4404: R13.1 U3.5(BST)
$1N4406: LED3.2(+) R16.1
$1N6263: C18.1 L6.1 U4.3(SW)
$1N6265: R17.1 U4.6(EN)
$1N6266: C17.1 R18.2 U4.7(VCC)
$1N6268: C19.2 R20.2 R21.2 U4.8(FB)
$1N6269: C18.2 R19.2
$1N6270: R19.1 U4.5(BST)
$1N6272: LED4.2(+) R22.1
$1N6580: C22.1 C23.2 D5.1(C) U5.1(VIN)
$1N6622: LED5.2(+) R23.2
$1N7021: C26.1 C27.2 D6.1(C) U6.1(VIN)
$1N7028: LED6.2(+) R24.2
$1N7425: C30.1 C31.2 D7.1(C) U7.1(VIN)
$1N7432: LED7.2(+) R25.2
$2N831: R26.1 R27.1 U8.9(CR)
$2N3111: Q2.1(B) R28.2
$2N3113: BUZZER1.2 D8.2(A) Q2.3(C)

Not connected (* = marked no-connect by the designer): B1 1(M3)*; B2 1(M3)*; F1 8* 13* 14*; H1 9*; H2 5* 6*; H3 5* 6*; H4 5* 6*; H5 5* 6*; H6 7* 8*; H9 2* 8*; S2 1*; U5 4(NC)*; U6 4(NC)*; U7 4(NC)*; U8 3(3V3)* 4(3V3)* 7(OF)* 8(WU)* 21(2DP)* 22(2DN)* 28(B15)* 69(C11)* 70(C12)* 72(C10)* 73(C7)* 75(C5)* 76(C6)* 78(C4)* 83(GND)*

## Notes on the sheets
sheet 1
- 电源输入
- 5V
- 5V上电时序
- 8V_1
- 8V_2
- 3V3
- 3V3_CSI
- 3V3_TFT
- 电机使能
- 电机电源
sheet 2
- 摄像头接口
- 编码器接口
- 电机接口
- 核心板
- LF
- RF
- IMU660RA
- LB
- RB
- 蓝牙接口
- 电气隔离
- 调参接口
- OPENART
- 电气隔离
- 蜂鸣器
- 电气隔离
- 舵机接口
- 电磁铁接口

# Board PCB1
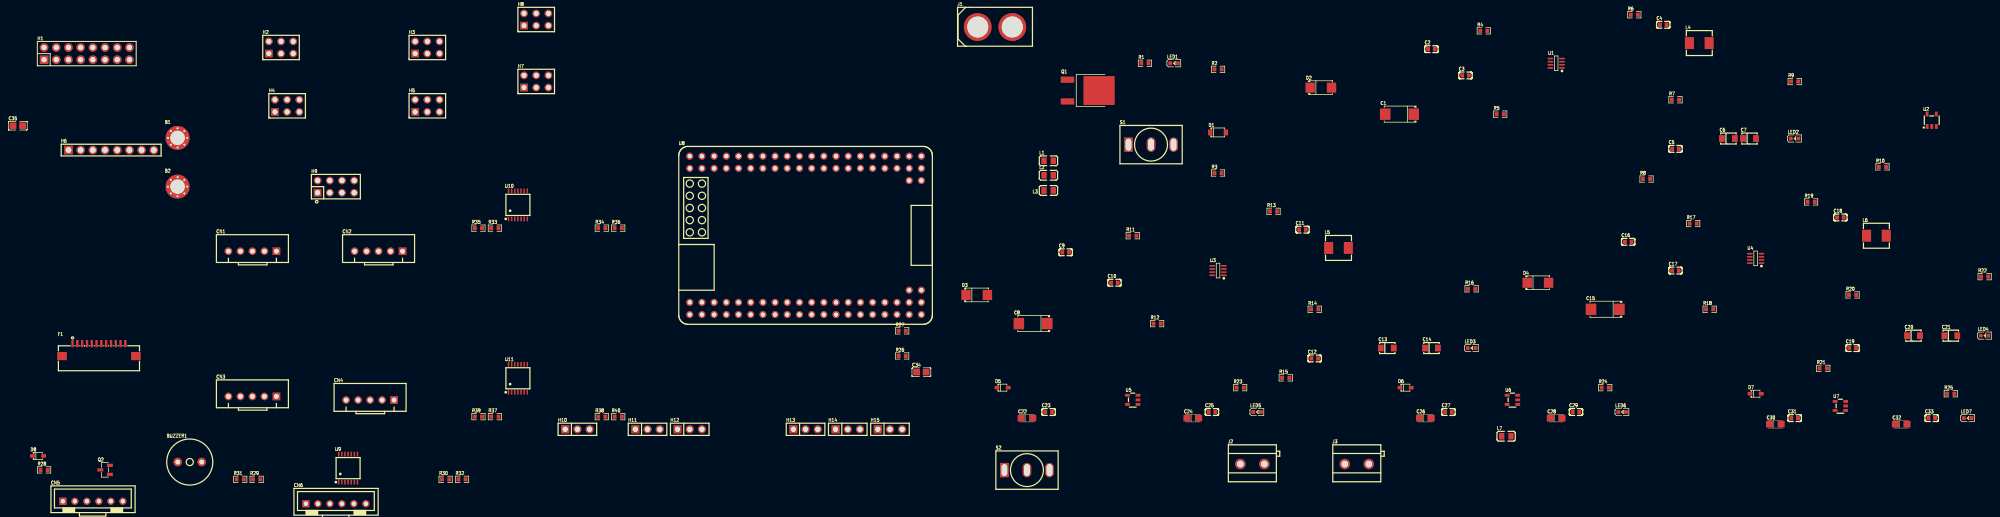
[diagram p2: board, top side]
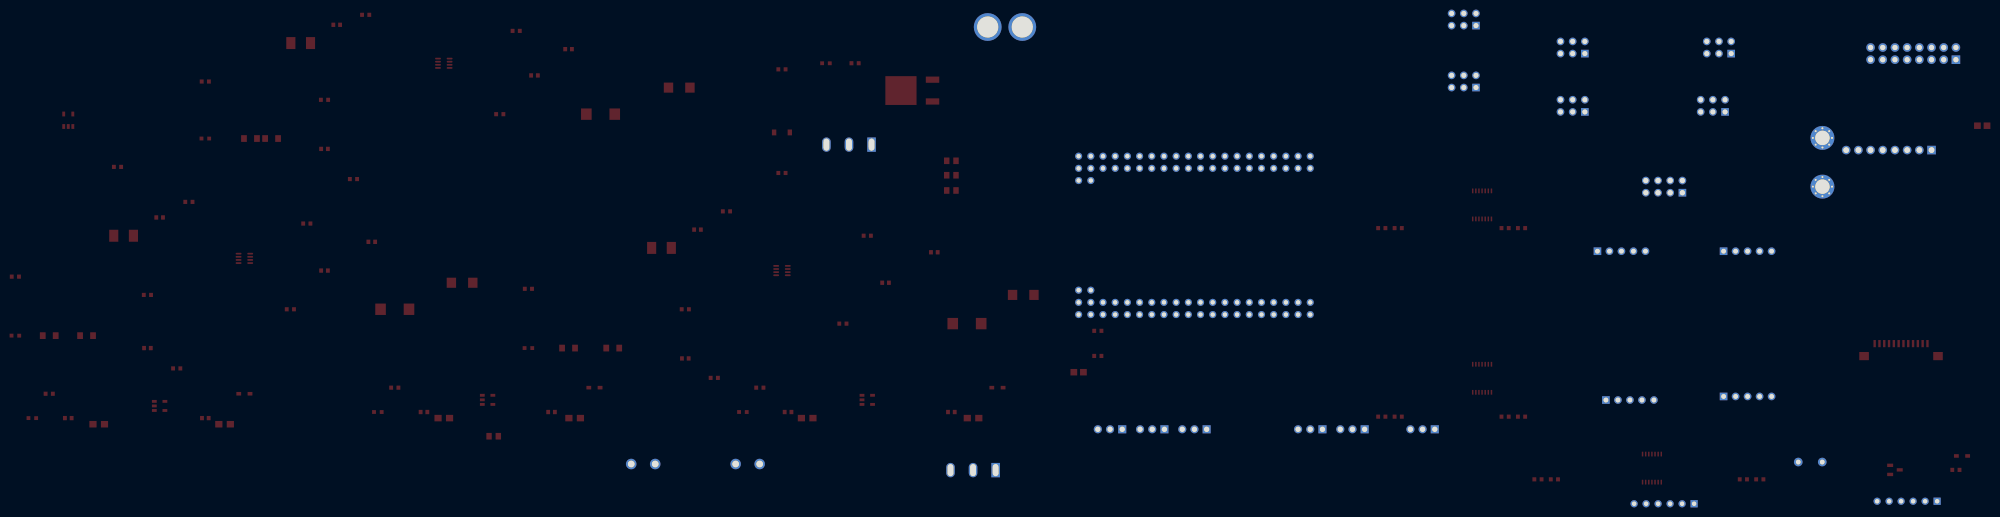
[diagram p3: board, bottom side, seen from below]

No outline. copper layers: Top Layer, Bottom Layer. Coordinates in mm from the lowest, leftmost part position.
Stack: Top Layer 0.035mm / Dielectric1 1.51mm FR4 er 4.5 / Bottom Layer 0.035mm

## Design rules (mm)
template: JLCPCB Capability(Two Layers Board)
spacing copperThickness1oz (default): track to track 0.102, other pairs 0.152 to 0.3
spacing copperThickness2oz: track to track 0.203, other pairs 0.152 to 0.3
track width copperThickness1oz (default): min 0.127, default 0.254, max 2.54
track width copperThickness2oz: min 0.203, default 0.254, max 2.54
differential pair differentialPair (default): width min 0.127, default 0.254, max 2.54; gap min 0.152, default 0.152
via viaSize (default): diameter min 0.5, default 0.61, max 10; hole min 0.3, default 0.305, max 6.3

## Placement (name value [footprint] x y rotation side)
B1  M3螺柱孔_JX  [M3]  33.29 76.27 0 top
B2  M3螺柱孔_JX  [M3]  33.29 66.11 0 top
BUZZER1  3000Hz  [BUZ-TH_BD9.6-P5.00-D0.7-FD]  35.83 8.7 0 top
C1  22uF  [CAP-SMD_L6.0-W3.2-R-RD]  287.87 81.22 0 top
C2  100nF  [C0603]  294.53 94.77 0 top
C3  100nF  [C0603]  301.63 89.3 0 top
C4  100nF  [C0603]  342.84 99.85 0 top
C5  33pF  [C0603]  345.38 73.98 0 top
C6  22uF  [CAP-SMD_L3.2-W1.6]  356.4 76.14 0 top
C7  22uF  [CAP-SMD_L3.2-W1.6]  360.8 76.14 0 top
C8  22uF  [CAP-SMD_L6.0-W3.2-R-RD]  211.52 37.55 0 top
C9  100nF  [C0603]  218.33 52.43 0 top
C10  100nF  [C0603]  228.48 46.08 0 top
C11  100nF  [C0603]  267.67 57.15 0 top
C12  33pF  [C0603]  270.21 30.29 0 top
C13  22uF  [CAP-SMD_L3.2-W1.6]  285.33 32.46 0 top
C14  22uF  [CAP-SMD_L3.2-W1.6]  294.53 32.46 0 top
C15  22uF  [CAP-SMD_L6.0-W3.2-R-RD]  330.74 40.55 0 top
C16  100nF  [C0603]  335.53 54.61 0 top
C17  100nF  [C0603]  345.38 48.62 0 top
C18  100nF  [C0603]  379.73 59.69 0 top
C19  33pF  [C0603]  382.27 32.46 0 top
C20  22uF  [CAP-SMD_L3.2-W1.6]  394.96 35.05 0 top
C21  22uF  [CAP-SMD_L3.2-W1.6]  402.73 35.05 0 top
C22  10uF  [CASE-A_3216]  210.25 17.85 0 top
C23  100nF  [C0603]  214.78 19.12 0 top
C24  10uF  [CASE-A_3216]  244.82 17.85 0 top
C25  100nF  [C0603]  248.8 19.12 0 top
C26  10uF  [CASE-A_3216]  293.26 17.85 0 top
C27  100nF  [C0603]  298.08 19.12 0 top
C28  10uF  [CASE-A_3216]  320.52 17.85 0 top
C29  100nF  [C0603]  324.65 19.12 0 top
C30  10uF  [CASE-A_3216]  366.19 16.58 0 top
C31  100nF  [C0603]  370.21 17.85 0 top
C32  10uF  [CASE-A_3216]  392.42 16.58 0 top
C33  100nF  [C0603]  398.76 17.85 0 top
C34  1uF  [C0805]  188.26 27.43 0 top
C35  10uF  [C0805]  0 78.81 0 top
CN1  XHB-5A  [XHB-TH_5PIN-V-PITCH2.50-R]  48.88 52.65 0 top
CN2  XHB-5A  [XHB-TH_5PIN-V-PITCH2.50-R]  75.17 52.65 0 top
CN3  XHB-5A  [XHB-TH_5PIN-V-PITCH2.50-R]  48.88 22.37 0 top
CN4  XHB-5A  [XHB-TH_5PIN-V-PITCH2.50-R]  73.4 21.62 0 top
CN5  BX-HA2.54-6PZZ  [CONN-TH_6P-P2.50_BX-HA2.54-6PZZ]  15.64 0.52 0 top
CN6  BX-HA2.54-6PZZ  [CONN-TH_6P-P2.50_BX-HA2.54-6PZZ]  66.28 0 0 top
D1  BZT52C16  [SOD-123_L2.7-W1.6-LS3.7-RD]  250.07 77.41 0 top
D2  SMAJ12A  [SMA_L4.4-W2.7-LS5.1-RD]  271.48 86.75 0 top
D3  SMAJ12A  [SMA_L4.4-W2.7-LS5.1-RD]  199.79 43.54 0 top
D4  SMAJ12A  [SMA_L4.4-W2.7-LS5.1-RD]  316.71 46.08 0 top
D5  1N5819WS  [SOD-323_L1.8-W1.3-LS2.5-RD]  205.17 24.2 0 top
D6  1N5819WS  [SOD-323_L1.8-W1.3-LS2.5-RD]  289.14 24.2 0 top
D7  1N5819WS  [SOD-323_L1.8-W1.3-LS2.5-RD]  362.07 22.93 0 top
D8  1N5819WS  [SOD-323_L1.8-W1.3-LS2.5-RD]  4.21 9.97 0 top
F1  FPC-1.0FX-12PWCR-H20  [FPC-SMD_XUNPU_FPC-1.0FX-12PWCR-H20]  16.91 32.08 0 top
H1  -  [HDR-TH_16P-P2.54-V-F-R2-C8-S2.54-1]  14.37 93.85 0 top
H2  -  [HDR-TH_6P-P2.54-V-R2-C3-S2.54_A2541WV-2X3P]  54.85 95.12 0 top
H3  -  [HDR-TH_6P-P2.54-V-R2-C3-S2.54_A2541WV-2X3P]  85.33 95.12 0 top
H4  -  [HDR-TH_6P-P2.54-V-R2-C3-S2.54_A2541WV-2X3P]  56.12 82.96 0 top
H5  -  [HDR-TH_6P-P2.54-V-R2-C3-S2.54_A2541WV-2X3P]  85.33 82.96 0 top
H6  -  [HDR-TH_8P-P2.54-V-F-1]  19.45 73.73 0 top
H7  -  [HDR-TH_6P-P2.54-V-R2-C3-S2.54_A2541WV-2X3P]  108.01 88.04 0 top
H8  -  [HDR-TH_6P-P2.54-V-R2-C3-S2.54_A2541WV-2X3P]  108.01 100.95 0 top
H9  -  [HDR-TH_8P-P2.54-V-F-R2-C4-S2.54-1]  66.28 66.11 0 top
H10  -  [HDR-TH_3P-P2.54-V-M]  116.6 15.52 0 top
H11  -  [HDR-TH_3P-P2.54-V-M]  131.21 15.52 0 top
H12  -  [HDR-TH_3P-P2.54-V-M]  140 15.52 0 top
H13  -  [HDR-TH_3P-P2.54-V-M]  164.13 15.52 0 top
H14  -  [HDR-TH_3P-P2.54-V-M]  172.92 15.52 0 top
H15  -  [HDR-TH_3P-P2.54-V-M]  181.72 15.52 0 top
J1  XT60  [CONN-TH_XT60]  203.6 99.39 0 top
J2  KF301-5.0-2P  [CONN-TH_P5.00_KF301-5.0-2P]  257.22 8.28 0 top
J3  KF301-5.0-2P  [CONN-TH_P5.00_KF301-5.0-2P]  278.98 8.28 0 top
L1  CBG201209U000T  [L0805]  214.78 71.5 0 top
L2  CBG201209U000T  [L0805]  214.78 68.49 0 top
L3  CBG201209U000T  [L0805]  214.78 65.31 0 top
L4  4.7uH  [IND-SMD_L5.4-W5.2_FXL0530]  350.34 96.04 0 top
L5  4.7uH  [IND-SMD_L5.4-W5.2_FXL0530]  275.17 53.34 0 top
L6  4.7uH  [IND-SMD_L5.4-W5.2_FXL0530]  387.23 55.88 0 top
L7  CBG201209U000T  [L0805]  310.13 14.08 0 top
LED1  NCD0603R1  [LED0603-RD_RED]  240.9 91.84 0 top
LED2  NCD0603W1  [LED0603-RD]  370.21 76.14 0 top
LED3  NCD0603W1  [LED0603-RD]  302.9 32.46 0 top
LED4  NCD0603W1  [LED0603-RD]  409.79 35.05 0 top
LED5  NCD0603W1  [LED0603-RD]  258.21 19.12 0 top
LED6  NCD0603W1  [LED0603-RD]  334.26 19.12 0 top
LED7  NCD0603W1  [LED0603-RD]  406.26 17.85 0 top
Q1  NCE60P50K  [TO-252-2_L6.6-W6.1-P4.57-LS9.9-TL-CW]  221.99 86.14 0 top
Q2  SS8050  [SOT-23-3_L2.9-W1.3-P1.90-LS2.4-BR]  18.18 7.06 0 top
R1  10kΩ  [R0603]  234.84 91.84 0 top
R2  4.7kΩ  [R0603]  250.07 90.56 0 top
R3  10kΩ  [R0603]  250.07 68.96 0 top
R4  100kΩ  [R0603]  305.44 98.58 0 top
R5  100kΩ  [R0603]  308.86 81.22 0 top
R6  10Ω  [R0603]  336.8 101.93 0 top
R7  40.2k  [R0603]  345.38 84.22 0 top
R8  5.49k  [R0603]  339.34 67.69 0 top
R9  10kΩ  [R0603]  370.21 88.03 0 top
R10  4.7kΩ  [R0603]  388.5 70.23 0 top
R11  100kΩ  [R0603]  232.29 55.88 0 top
R12  100kΩ  [R0603]  237.38 37.55 0 top
R13  10Ω  [R0603]  261.63 60.96 0 top
R14  40.2k  [R0603]  270.21 40.55 0 top
R15  5.49k  [R0603]  264.17 26.25 0 top
R16  10kΩ  [R0603]  302.9 44.81 0 top
R17  100kΩ  [R0603]  349.07 58.42 0 top
R18  100kΩ  [R0603]  352.49 40.55 0 top
R19  10Ω  [R0603]  373.63 62.93 0 top
R20  40.2k  [R0603]  382.27 43.54 0 top
R21  5.49k  [R0603]  376.17 28.22 0 top
R22  10kΩ  [R0603]  409.79 47.35 0 top
R23  10kΩ  [R0603]  254.68 24.2 0 top
R24  10kΩ  [R0603]  330.74 24.2 0 top
R25  10kΩ  [R0603]  402.73 22.93 0 top
R26  10kΩ  [R0603]  184.26 30.81 0 top
R27  0Ω  [R0603]  184.26 36.05 0 top
R28  1kΩ  [R0603]  5.48 7.06 0 top
R29  10kΩ  [R0603]  49.77 5.09 0 top
R30  10kΩ  [R0603]  89.14 5.09 0 top
R31  10kΩ  [R0603]  46.34 5.09 0 top
R32  10kΩ  [R0603]  92.56 5.09 0 top
R33  10kΩ  [R0603]  99.4 57.46 0 top
R34  10kΩ  [R0603]  121.68 57.46 0 top
R35  10kΩ  [R0603]  95.98 57.46 0 top
R36  10kΩ  [R0603]  125.1 57.46 0 top
R37  10kΩ  [R0603]  99.4 18.16 0 top
R38  10kΩ  [R0603]  121.68 18.16 0 top
R39  10kΩ  [R0603]  95.98 18.16 0 top
R40  10kΩ  [R0603]  125.1 18.16 0 top
S1  MT-0-102-A101-M200-RS  [SW-TH_MT-0-103-A101-M200-RS]  236.1 74.87 0 top
S2  MT-0-102-A101-M200-RS  [SW-TH_MT-0-103-A101-M200-RS]  210.25 7.01 0 top
U1  -  [tsot-23-8_l2.9-w1.6-p0.65-ls2.8-br]  320.52 91.84 0 top
U2  RY2121  [SOT-23-5_L3.0-W1.6-P0.95-LS2.8-BL]  398.76 79.95 0 top
U3  -  [tsot-23-8_l2.9-w1.6-p0.65-ls2.8-br]  250.07 48.62 0 top
U4  -  [tsot-23-8_l2.9-w1.6-p0.65-ls2.8-br]  362.07 51.16 0 top
U5  RT9013  [SOT-23-5_L2.9-W1.6-P0.95-LS2.8-BR]  232.29 21.66 0 top
U6  RT9013  [SOT-23-5_L2.9-W1.6-P0.95-LS2.8-BR]  311.4 21.66 0 top
U7  RT9013  [SOT-23-5_L2.9-W1.6-P0.95-LS2.8-BR]  379.73 20.39 0 top
U8  MIMXRT1064xVL_CoreBoard  [MIMXRT1064xVL_CoreBoard - 3D]  164.13 55.95 0 top
U9  SN74HC125PWR  [TSSOP-14_L5.0-W4.4-P0.65-LS6.5-BL]  68.82 7.43 0 top
U10  SN74HC125PWR  [TSSOP-14_L5.0-W4.4-P0.65-LS6.5-BL]  104.2 62.3 0 top
U11  SN74HC125PWR  [TSSOP-14_L5.0-W4.4-P0.65-LS6.5-BL]  104.2 26.16 0 top

## Footprints (pads in the part's own frame, mm; a bottom-side part is the same pattern mirrored in y, then rotated)
BUZ-TH_BD9.6-P5.00-D0.7-FD
  round 1.8 hole 1: 1(-2.5,0) 2(2.5,0)
C0603
  rect 0.8x0.9 smd: 1(-0.7,0) 2(0.7,0)
C0805
  rect 1.41x1.35 smd: 1(-1,0) 2(1,0)
CAP-SMD_L3.2-W1.6
  rect 1.2x1.4 smd: 1(-1.35,0) 2(1.35,0)
CAP-SMD_L6.0-W3.2-R-RD
  rect 2.208x2.376 smd: 1(2.961,0) 2(-2.961,0)
CASE-A_3216
  rect 1.5x1.359 smd: 1(-1.2,0) 2(1.2,0)
CONN-TH_6P-P2.50_BX-HA2.54-6PZZ
  rect 1.524x1.524 hole 0.914: 1(-6.25,0)
  round 1.524 hole 0.914: 2(-3.75,0) 3(-1.25,0) 4(1.25,0) 5(3.75,0) 6(6.25,0)
CONN-TH_P5.00_KF301-5.0-2P
  round 2.2 hole 1.4: 1(-2.5,0) 2(2.5,0)
CONN-TH_XT60
  round 5.8 hole 4.4: 1(-3.6,0) 2(3.6,0)
FPC-SMD_XUNPU_FPC-1.0FX-12PWCR-H20
  rect 0.5x1.5 smd: 1(-5.5,1.3) 2(-4.5,1.3) 3(-3.5,1.3) 4(-2.5,1.3) 5(-1.5,1.3) 6(-0.5,1.3) 7(0.5,1.3) 8(1.5,1.3) 9(2.5,1.3) 10(3.5,1.3) 11(4.5,1.3) 12(5.5,1.3)
  rect 2x1.7 smd: 13(7.7,-1.3) 14(-7.7,-1.3)
HDR-TH_3P-P2.54-V-M
  rect 1.7x1.7 hole 1.1: 1(-2.54,0)
  round 1.7 hole 1.1: 2(0,0) 3(2.54,0)
HDR-TH_6P-P2.54-V-R2-C3-S2.54_A2541WV-2X3P
  rect 1.6x1.6 hole 1.05: 1(-2.54,-1.27)
  round 1.6 hole 1.05: 2(-2.54,1.27) 3(0,-1.27) 4(0,1.27) 5(2.54,-1.27) 6(2.54,1.27)
HDR-TH_8P-P2.54-V-F-1
  rect 1.8x1.8 hole 1.2: 1(-8.89,0)
  round 1.8 hole 1.2: 2(-6.35,0) 3(-3.81,0) 4(-1.27,0) 5(1.27,0) 6(3.81,0) 7(6.35,0) 8(8.89,0)
HDR-TH_8P-P2.54-V-F-R2-C4-S2.54-1
  rect 1.6x1.6 hole 1.1: 1(-3.81,-1.27)
  round 1.6 hole 1.1: 2(-3.81,1.27) 3(-1.27,-1.27) 4(-1.27,1.27) 5(1.27,-1.27) 6(1.27,1.27) 7(3.81,-1.27) 8(3.81,1.27)
HDR-TH_16P-P2.54-V-F-R2-C8-S2.54-1
  rect 1.8x1.8 hole 1.1: 1(-8.89,-1.27)
  round 1.8 hole 1.1: 2(-8.89,1.27) 3(-6.35,-1.27) 4(-6.35,1.27) 5(-3.81,-1.27) 6(-3.81,1.27) 7(-1.27,-1.27) 8(-1.27,1.27) 9(1.27,-1.27) 10(1.27,1.27) 11(3.81,-1.27) 12(3.81,1.27) 13(6.35,-1.27) 14(6.35,1.27) 15(8.89,-1.27) 16(8.89,1.27)
IND-SMD_L5.4-W5.2_FXL0530
  rect 1.9x2.5 smd: 1(-2.05,0) 2(2.05,0)
L0805
  rect 1.133x1.377 smd: 1(-0.966,0) 2(0.966,0)
LED0603-RD
  rect 0.8x0.8 smd: 1(-0.799,-0.004) 2(0.799,0.004)
LED0603-RD_RED
  rect 0.8x0.8 smd: 1(-0.799,-0.004) 2(0.799,0.004)
M3
  round 0.6 hole 0.405x0.4: 1(-2,0) 1(-1.41,1.409) 1(-1.41,-1.41) 1(0,2) 1(0,-2) 1(1.41,1.409) 1(1.41,-1.41) 1(2,0)
  round 5 hole 3.005x3: 1(0,0)
MIMXRT1064xVL_CoreBoard - 3D
  round 1.5 hole 0.9: 1(-24.13,-16.51) 2(-24.13,-13.97) 3(-21.59,-16.51) 4(-21.59,-13.97) 5(-19.05,-16.51) 6(-19.05,-13.97) 7(-16.51,-16.51) 8(-16.51,-13.97) 9(-13.97,-16.51) 10(-13.97,-13.97) 11(-11.43,-16.51) 12(-11.43,-13.97) 13(-8.89,-16.51) 14(-8.89,-13.97) 15(-6.35,-16.51) 16(-6.35,-13.97) 17(-3.81,-16.51) 18(-3.81,-13.97) 19(-1.27,-16.51) 20(-1.27,-13.97) 21(1.27,-16.51) 22(1.27,-13.97) 23(3.81,-16.51) 24(3.81,-13.97) 25(6.35,-16.51) 26(6.35,-13.97) 27(8.89,-16.51) 28(8.89,-13.97) 29(11.43,-16.51) 30(11.43,-13.97) 31(13.97,-16.51) 32(13.97,-13.97) 33(16.51,-16.51) 34(16.51,-13.97) 35(19.05,-16.51) 36(19.05,-13.97) 37(21.59,-16.51) 38(21.59,-13.97) 39(24.13,-16.51) 40(24.13,-13.97) 41(21.59,-11.43) 42(24.13,-11.43) 43(24.13,11.43) 44(21.59,11.43) 45(24.13,13.97) 46(24.13,16.51) 47(21.59,13.97) 48(21.59,16.51) 49(19.05,13.97) 50(19.05,16.51) 51(16.51,13.97) 52(16.51,16.51) 53(13.97,13.97) 54(13.97,16.51) 55(11.43,13.97) 56(11.43,16.51) 57(8.89,13.97) 58(8.89,16.51) 59(6.35,13.97) 60(6.35,16.51) 61(3.81,13.97) 62(3.81,16.51) 63(1.27,13.97) 64(1.27,16.51) 65(-1.27,13.97) 66(-1.27,16.51) 67(-3.81,13.97) 68(-3.81,16.51) 69(-6.35,13.97) 70(-6.35,16.51) 71(-8.89,13.97) 72(-8.89,16.51) 73(-11.43,13.97) 74(-11.43,16.51) 75(-13.97,13.97) 76(-13.97,16.51) 77(-16.51,13.97) 78(-16.51,16.51) 79(-19.05,13.97) 80(-19.05,16.51) 81(-21.59,13.97) 82(-21.59,16.51) 83(-24.13,13.97) 84(-24.13,16.51)
R0603
  rect 0.806x0.864 smd: 1(-0.753,0) 2(0.753,0)
SMA_L4.4-W2.7-LS5.1-RD
  rect 1.96x2.1 smd: 1(-2.23,0) 2(2.23,0)
SOD-123_L2.7-W1.6-LS3.7-RD
  rect 0.91x1.22 smd: 1(-1.635,0) 2(1.635,0)
SOD-323_L1.8-W1.3-LS2.5-RD
  rect 1x0.75 smd: 1(-1.173,0) 2(1.173,0)
SOT-23-3_L2.9-W1.3-P1.90-LS2.4-BR
  rect 1.25x0.7 smd: 1(1,-0.95) 2(1,0.95) 3(-1,0)
SOT-23-5_L2.9-W1.6-P0.95-LS2.8-BR
  rect 1.001x0.6 smd: 1(1.1,-0.95) 2(1.1,0) 3(1.1,0.95) 4(-1.1,0.95) 5(-1.1,-0.95)
SOT-23-5_L3.0-W1.6-P0.95-LS2.8-BL
  rect 0.6x1 smd: 1(-0.95,-1.3) 2(0,-1.3) 3(0.95,-1.3) 4(0.95,1.3) 5(-0.95,1.3)
SW-TH_MT-0-103-A101-M200-RS
  rect 1.8x3 hole 1.2x2.5: 1(-4.7,0)
  oval 1.8x3 hole 1.2x2.5: 2(0,0) 3(4.7,0)
TO-252-2_L6.6-W6.1-P4.57-LS9.9-TL-CW
  rect 2.8x1.3 smd: 1(-3.292,2.273) 3(-3.292,-2.273)
  rect 6.5x6 smd: 2(3.292,0)
tsot-23-8_l2.9-w1.6-p0.65-ls2.8-br
  oval 1.222x0.364 smd: 1(1.211,-0.975) 2(1.211,-0.325) 3(1.211,0.325) 4(1.211,0.975) 5(-1.211,0.975) 6(-1.211,0.325) 7(-1.211,-0.325) 8(-1.211,-0.975)
TSSOP-14_L5.0-W4.4-P0.65-LS6.5-BL
  rect 0.305x0.991 smd: 1(-1.95,-2.925) 2(-1.3,-2.925) 3(-0.65,-2.925) 4(0,-2.925) 5(0.65,-2.925) 6(1.3,-2.925) 7(1.95,-2.925) 8(1.95,2.925) 9(1.3,2.925) 10(0.65,2.925) 11(0,2.925) 12(-0.65,2.925) 13(-1.3,2.925) 14(-1.95,2.925)
XHB-TH_5PIN-V-PITCH2.50-R
  rect 1.6x1.6 hole 1: 1(5,0)
  round 1.6 hole 1: 2(2.5,0) 3(0,0) 4(-2.5,0) 5(-5,0)

## Nets
As in the schematic.

Pads without a net: B1 1; B2 1; F1 8 13 14; H1 9; H2 5 6; H3 5 6; H4 5 6; H5 5 6; H6 7 8; H9 2 8; S2 1; U5 4; U6 4; U7 4; U8 3 4 7 8 21 22 28 69 70 72 73 75 76 78 83
